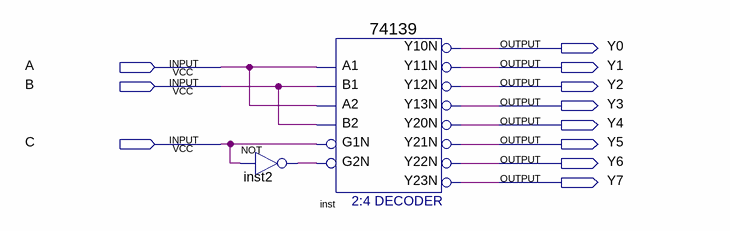
[diagram p0: schematic sheet]
// Quartus schematic three_line_to_eight_decimal_decoder.bdf as structural Verilog: 2 symbols, 11 pins
module three_line_to_eight_decimal_decoder (
  input  A,
  input  B,
  input  C,
  output Y0,
  output Y1,
  output Y2,
  output Y3,
  output Y4,
  output Y5,
  output Y6,
  output Y7
);

  wire inst2_out;

  not inst2 (inst2_out, C);
  \74139  inst (
    .A1(A), .A2(A), .B1(B), .B2(B), .G1N(C), .G2N(inst2_out), .Y10N(Y0), .Y20N(Y4), .Y13N(Y3), .Y12N(Y2),
    .Y11N(Y1), .Y21N(Y5), .Y22N(Y6), .Y23N(Y7));
endmodule
